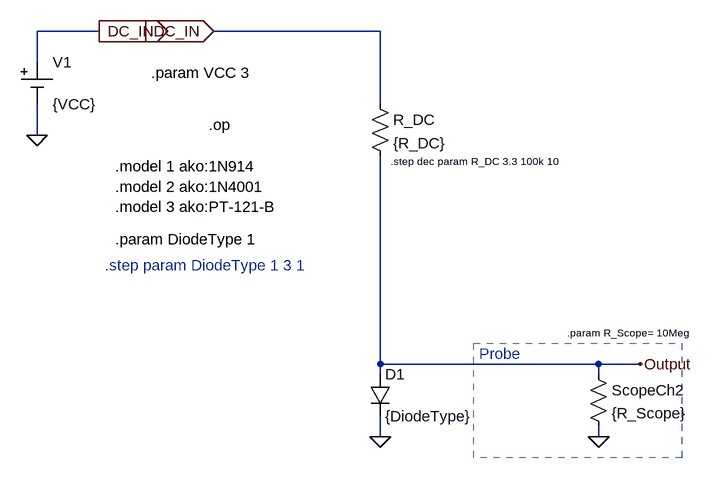
[diagram p0: schematic DiodeCircuit.asc]
DiodeCircuit.asc, the LTspice schematic file:
Version 4
SHEET 1 940 680
WIRE -192 -112 -288 -112
WIRE 240 -112 -16 -112
WIRE -288 -64 -288 -112
WIRE 240 0 240 -112
WIRE -288 48 -288 0
WIRE 240 400 240 80
WIRE 576 400 240 400
WIRE 640 400 576 400
WIRE 240 416 240 400
WIRE 576 416 576 400
WIRE 240 512 240 480
WIRE 576 512 576 496
FLAG 240 512 0
FLAG 576 512 0
FLAG 640 400 Output
FLAG -288 48 0
FLAG -192 -112 DC_IN
IOPIN -192 -112 Out
FLAG -16 -112 DC_IN
IOPIN -16 -112 In
SYMBOL diode 224 416 R0
SYMATTR InstName D1
SYMATTR Value {DiodeType}
SYMBOL res 224 -16 R0
SYMATTR InstName R_DC
SYMATTR Value {R_DC}
SYMBOL res 560 400 R0
SYMATTR InstName ScopeCh2
SYMATTR Value {R_Scope}
SYMBOL Misc\\cell -288 -64 R0
WINDOW 123 0 0 Left 0
WINDOW 39 0 0 Left 0
SYMATTR InstName V1
SYMATTR Value {VCC}
TEXT 256 88 Left 1 !.step dec param R_DC 3.3 100k 10
TEXT 528 352 Left 1 !.param R_Scope= 10Meg
TEXT -184 248 Left 2 ;.step param DiodeType 1 3 1
TEXT -168 96 Left 2 !.model 1 ako:1N914\n.model 2 ako:1N4001\n.model 3 ako:PT-121-B
TEXT 392 384 Left 2 ;Probe
TEXT -168 208 Left 2 !.param DiodeType 1
TEXT -24 32 Left 2 !.op
TEXT -112 -48 Left 2 !.param VCC 3
RECTANGLE Normal 704 544 384 368 2

The netlist it stands for:
* DiodeCircuit.asc
D1 Output 0 {DiodeType}
R_DC DC_IN Output {R_DC}
R§ScopeCh2 Output 0 {R_Scope}
V1 DC_IN 0 {VCC}
.model D D
.lib standard.dio
.step dec param R_DC 3.3 100k 10
.param R_Scope= 10Meg
* .step param DiodeType 1 3 1
.model 1 ako:1N914
.model 2 ako:1N4001
.model 3 ako:PT-121-B
* Probe
.param DiodeType 1
.op
.param VCC 3
.backanno
.end